# EasyEDA Pro project OURs_PHONE_EPRO_FILE_2025-04-21.epro, schematic OURS PHONE_CONNECTORS_FLIP

## Sheets
1 CONNECTORS: Board Name: OURS PHONE_CONNECTORS_FLIP; Create Date: 2024-12-30; Page Name: CONNECTORS; Project Name: BackupProjects_abdulrehmanbinafsar_personal_0_20241230; Schematic Name: OURS PHONE_CONNECTORS_FLIP; Update Date: 2025-01-07; Add into BOM: yes; Company: Your Company; Convert to PCB: yes; Date: 2024-12-04; Draw By: Abdul Rehman; REV: 1.0; Sheet: 1/1
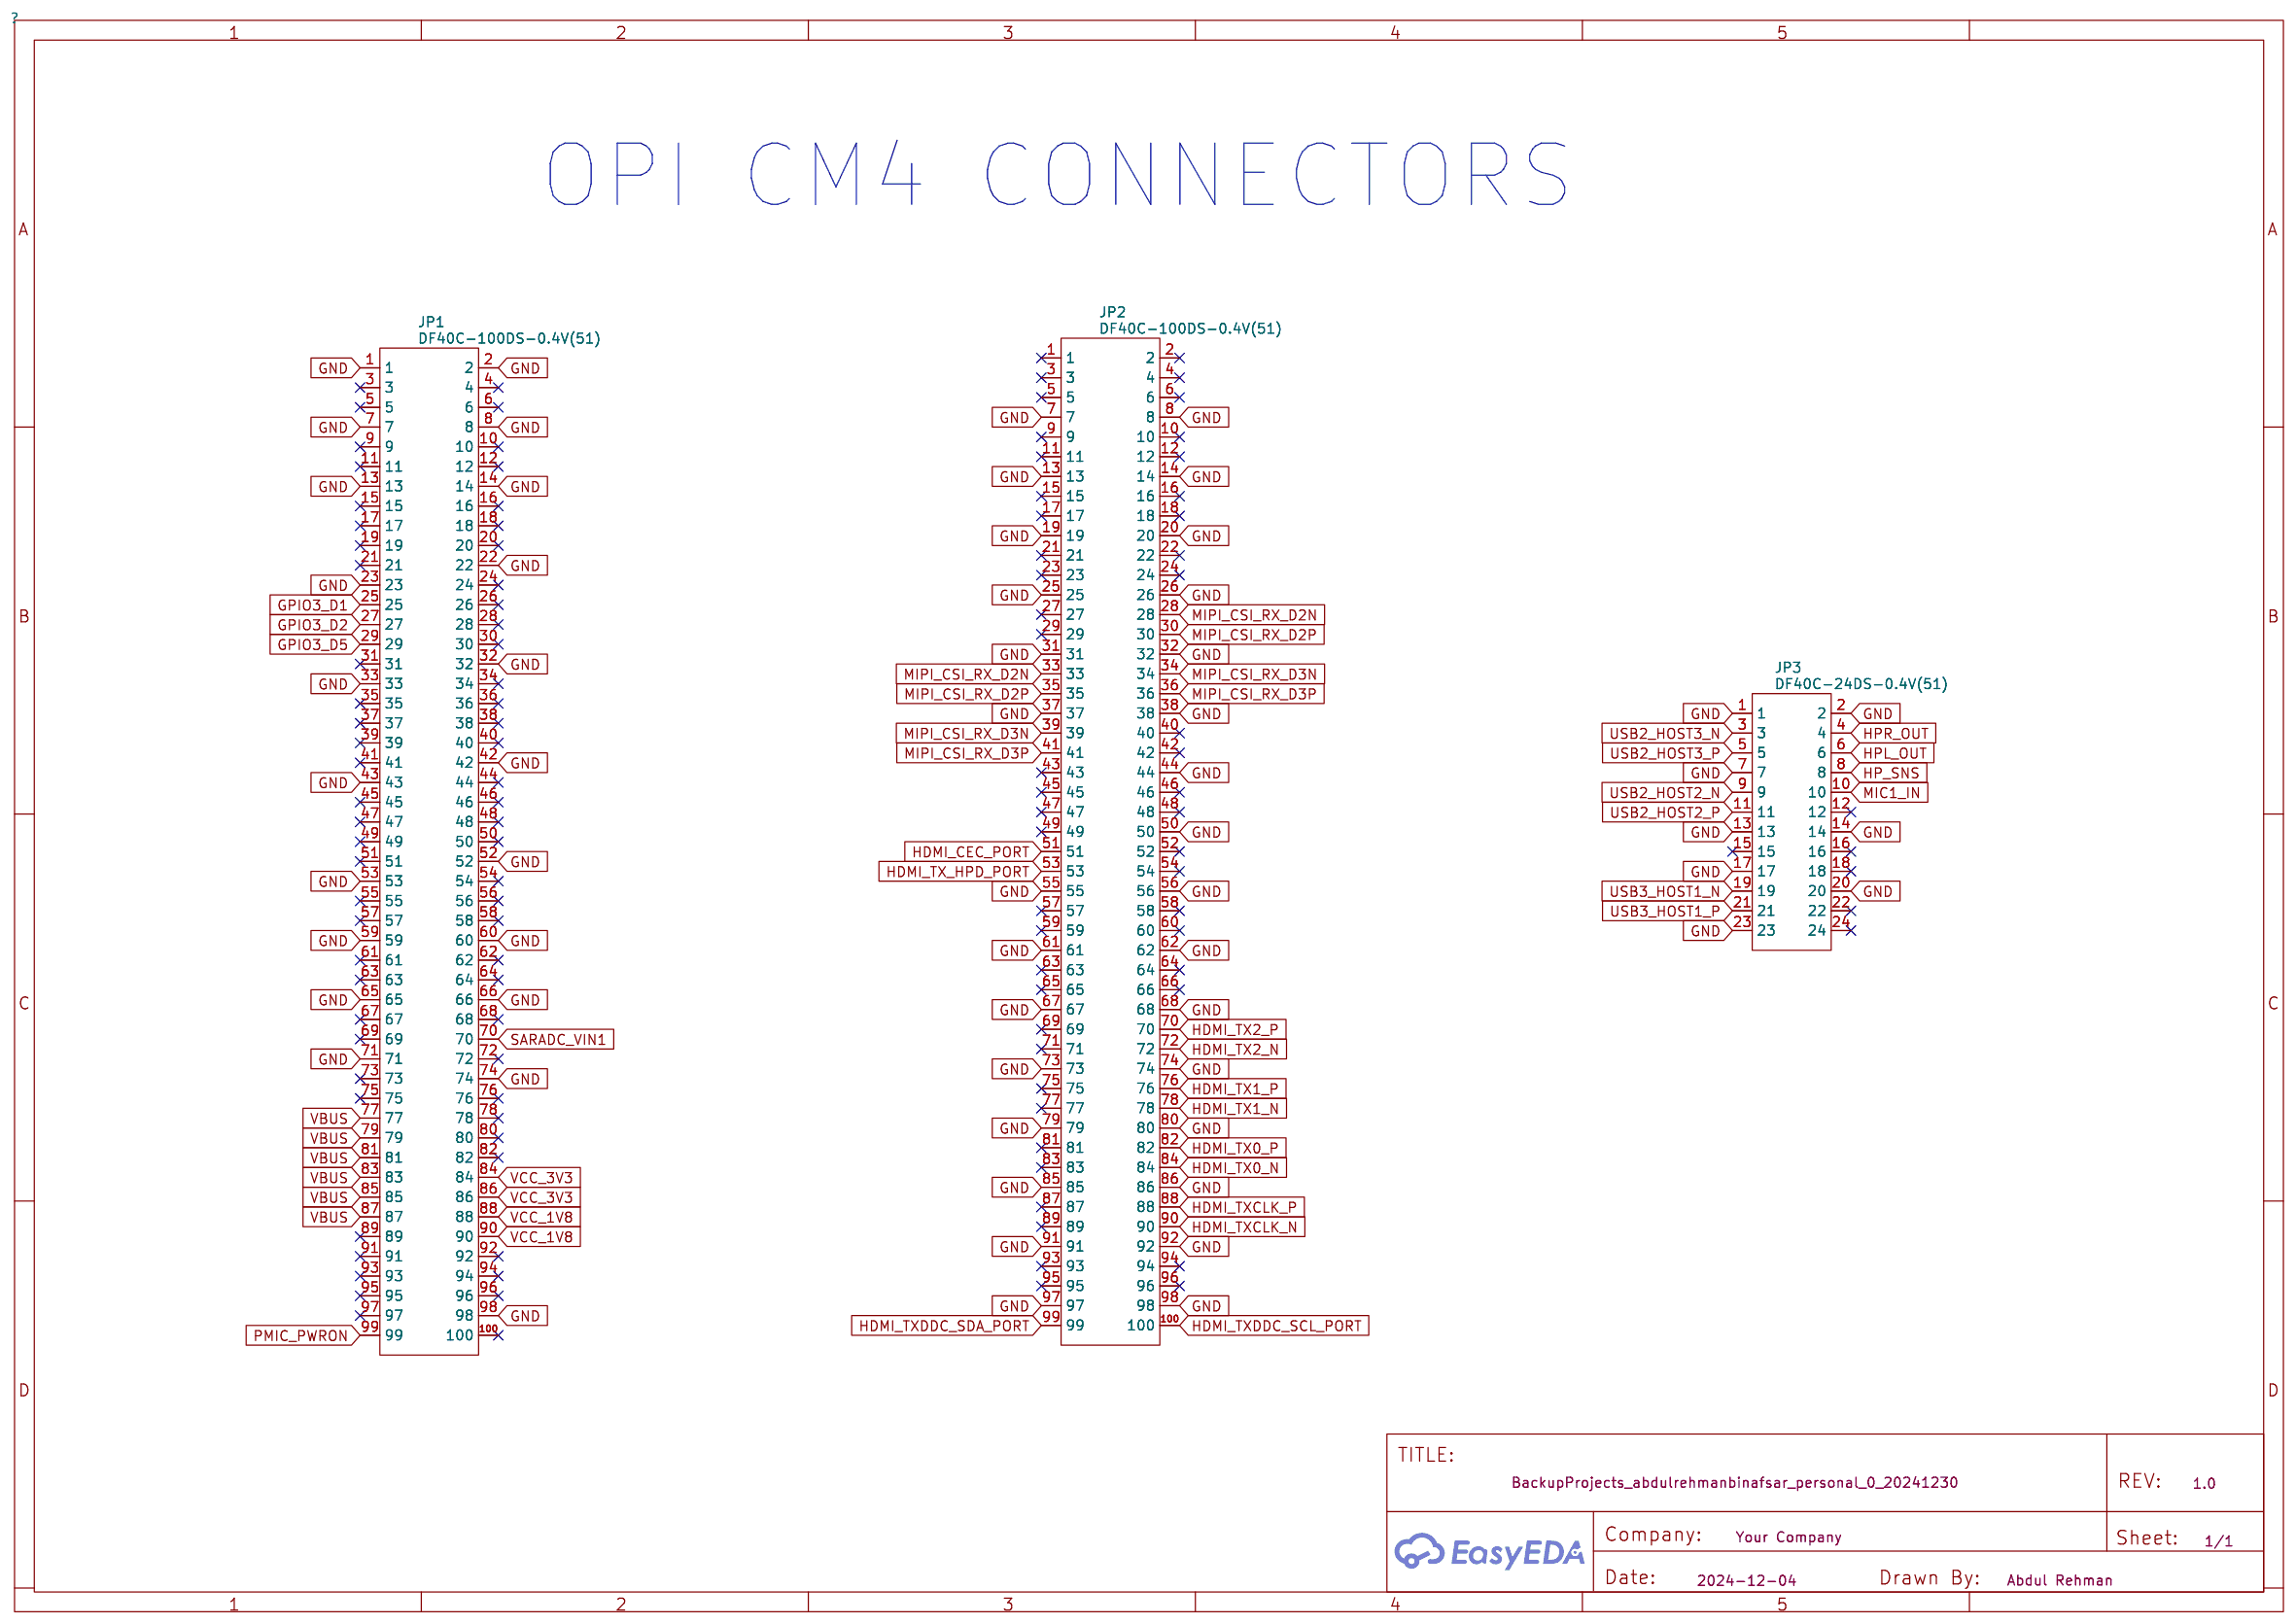
[diagram p0: CONNECTORS]
2 CIRCUITRY: Page Name: CIRCUITRY; Update Date: 2025-01-22; Date: 2024-12-06
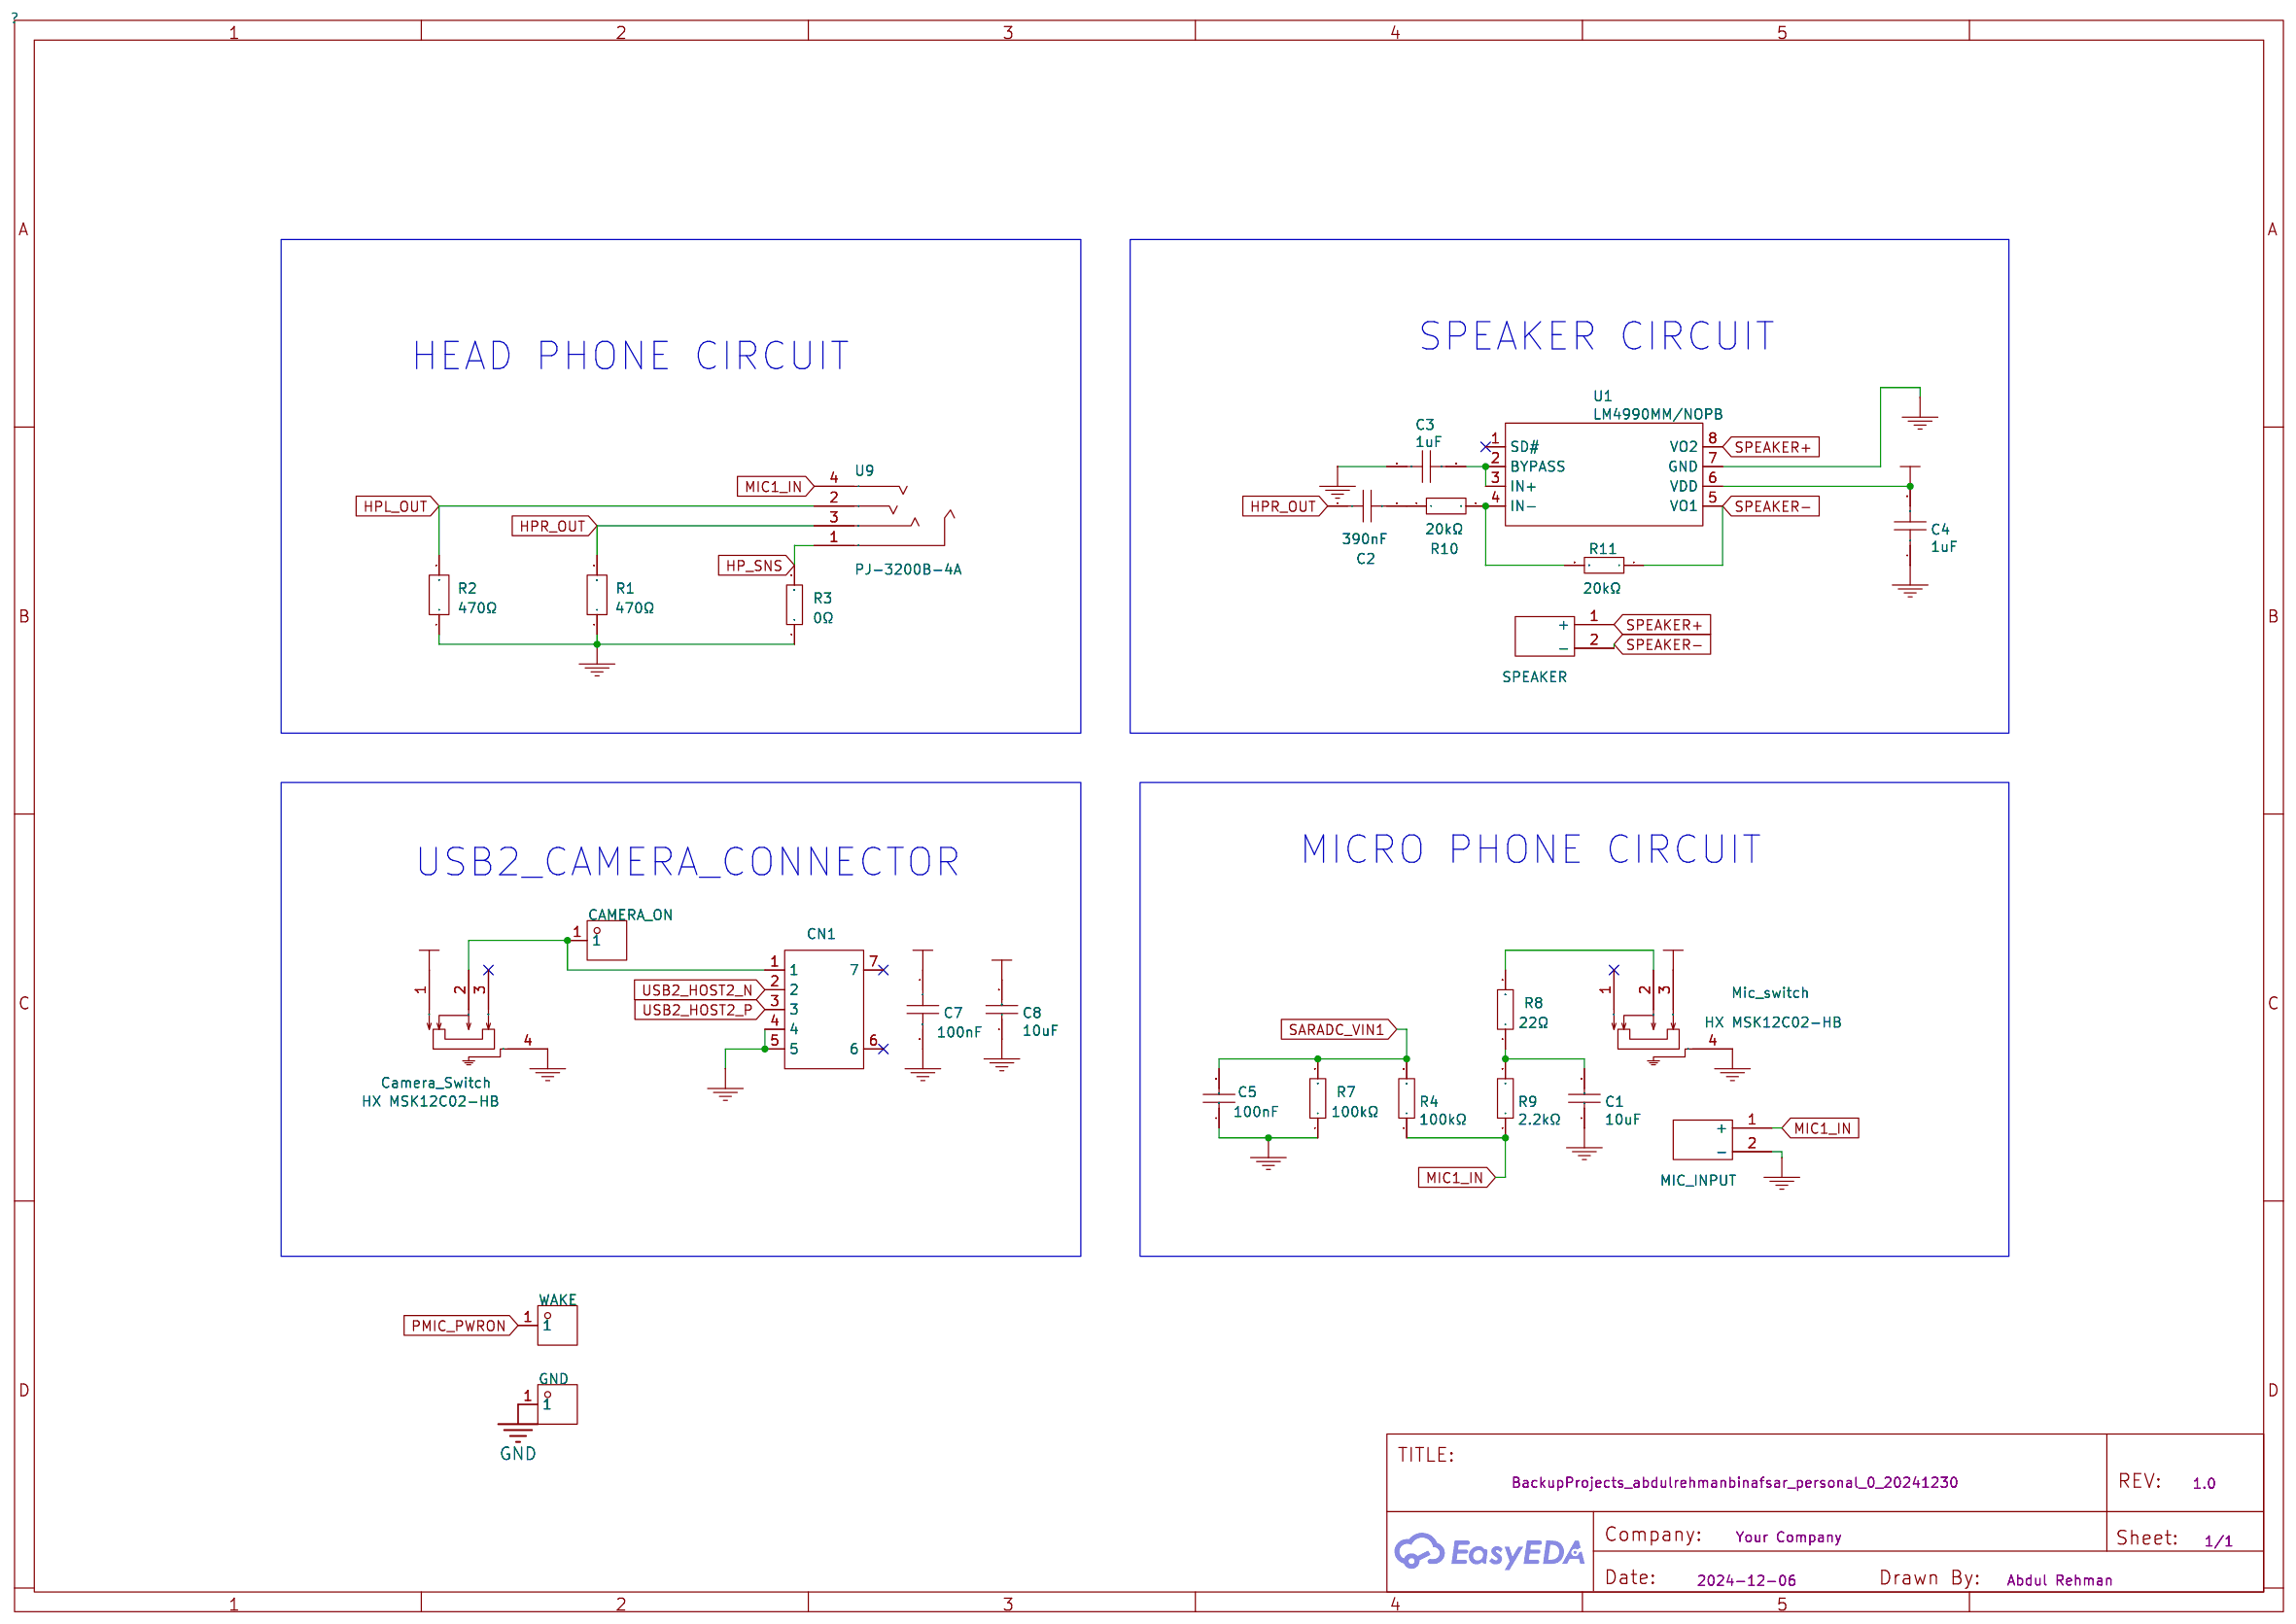
[diagram p1: CIRCUITRY]
3 SIM Module: Page Name: SIM Module; Update Date: 2025-01-22; Date: 2024-12-06
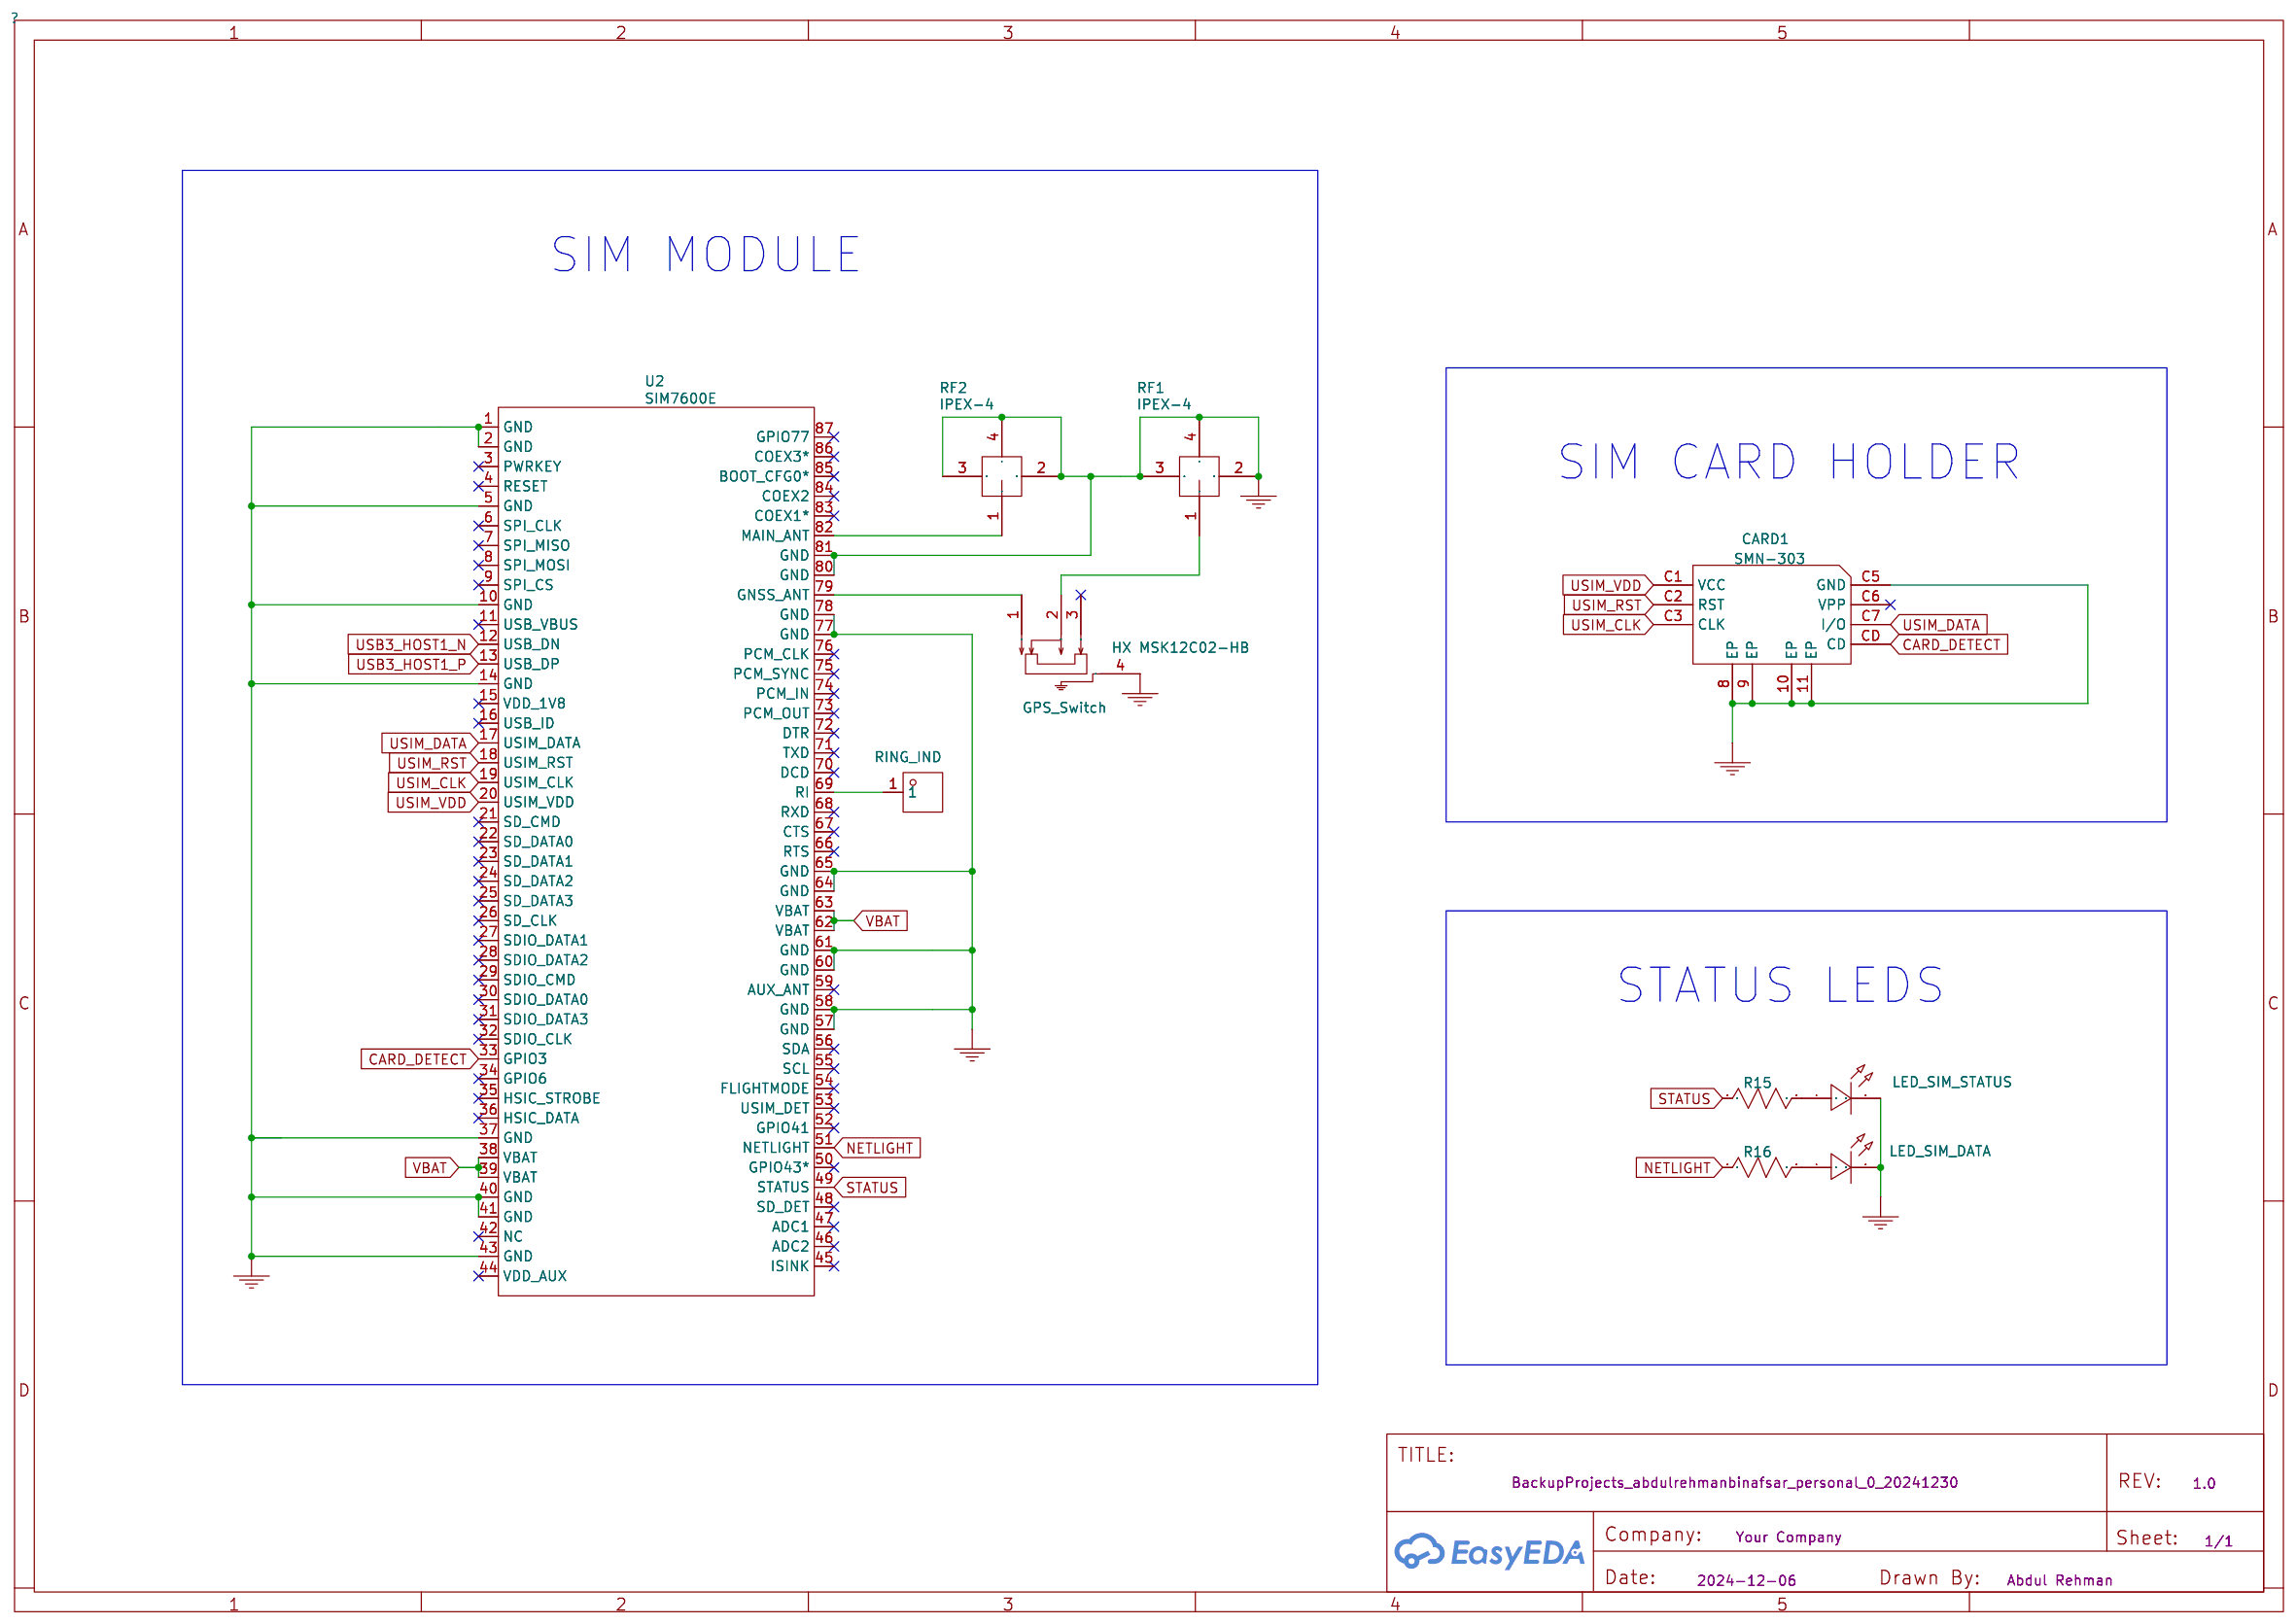
[diagram p2: SIM Module]
4 CPBR CIRCUIT: Page Name: CPBR CIRCUIT; Update Date: 2025-01-22; Date: 2024-12-08
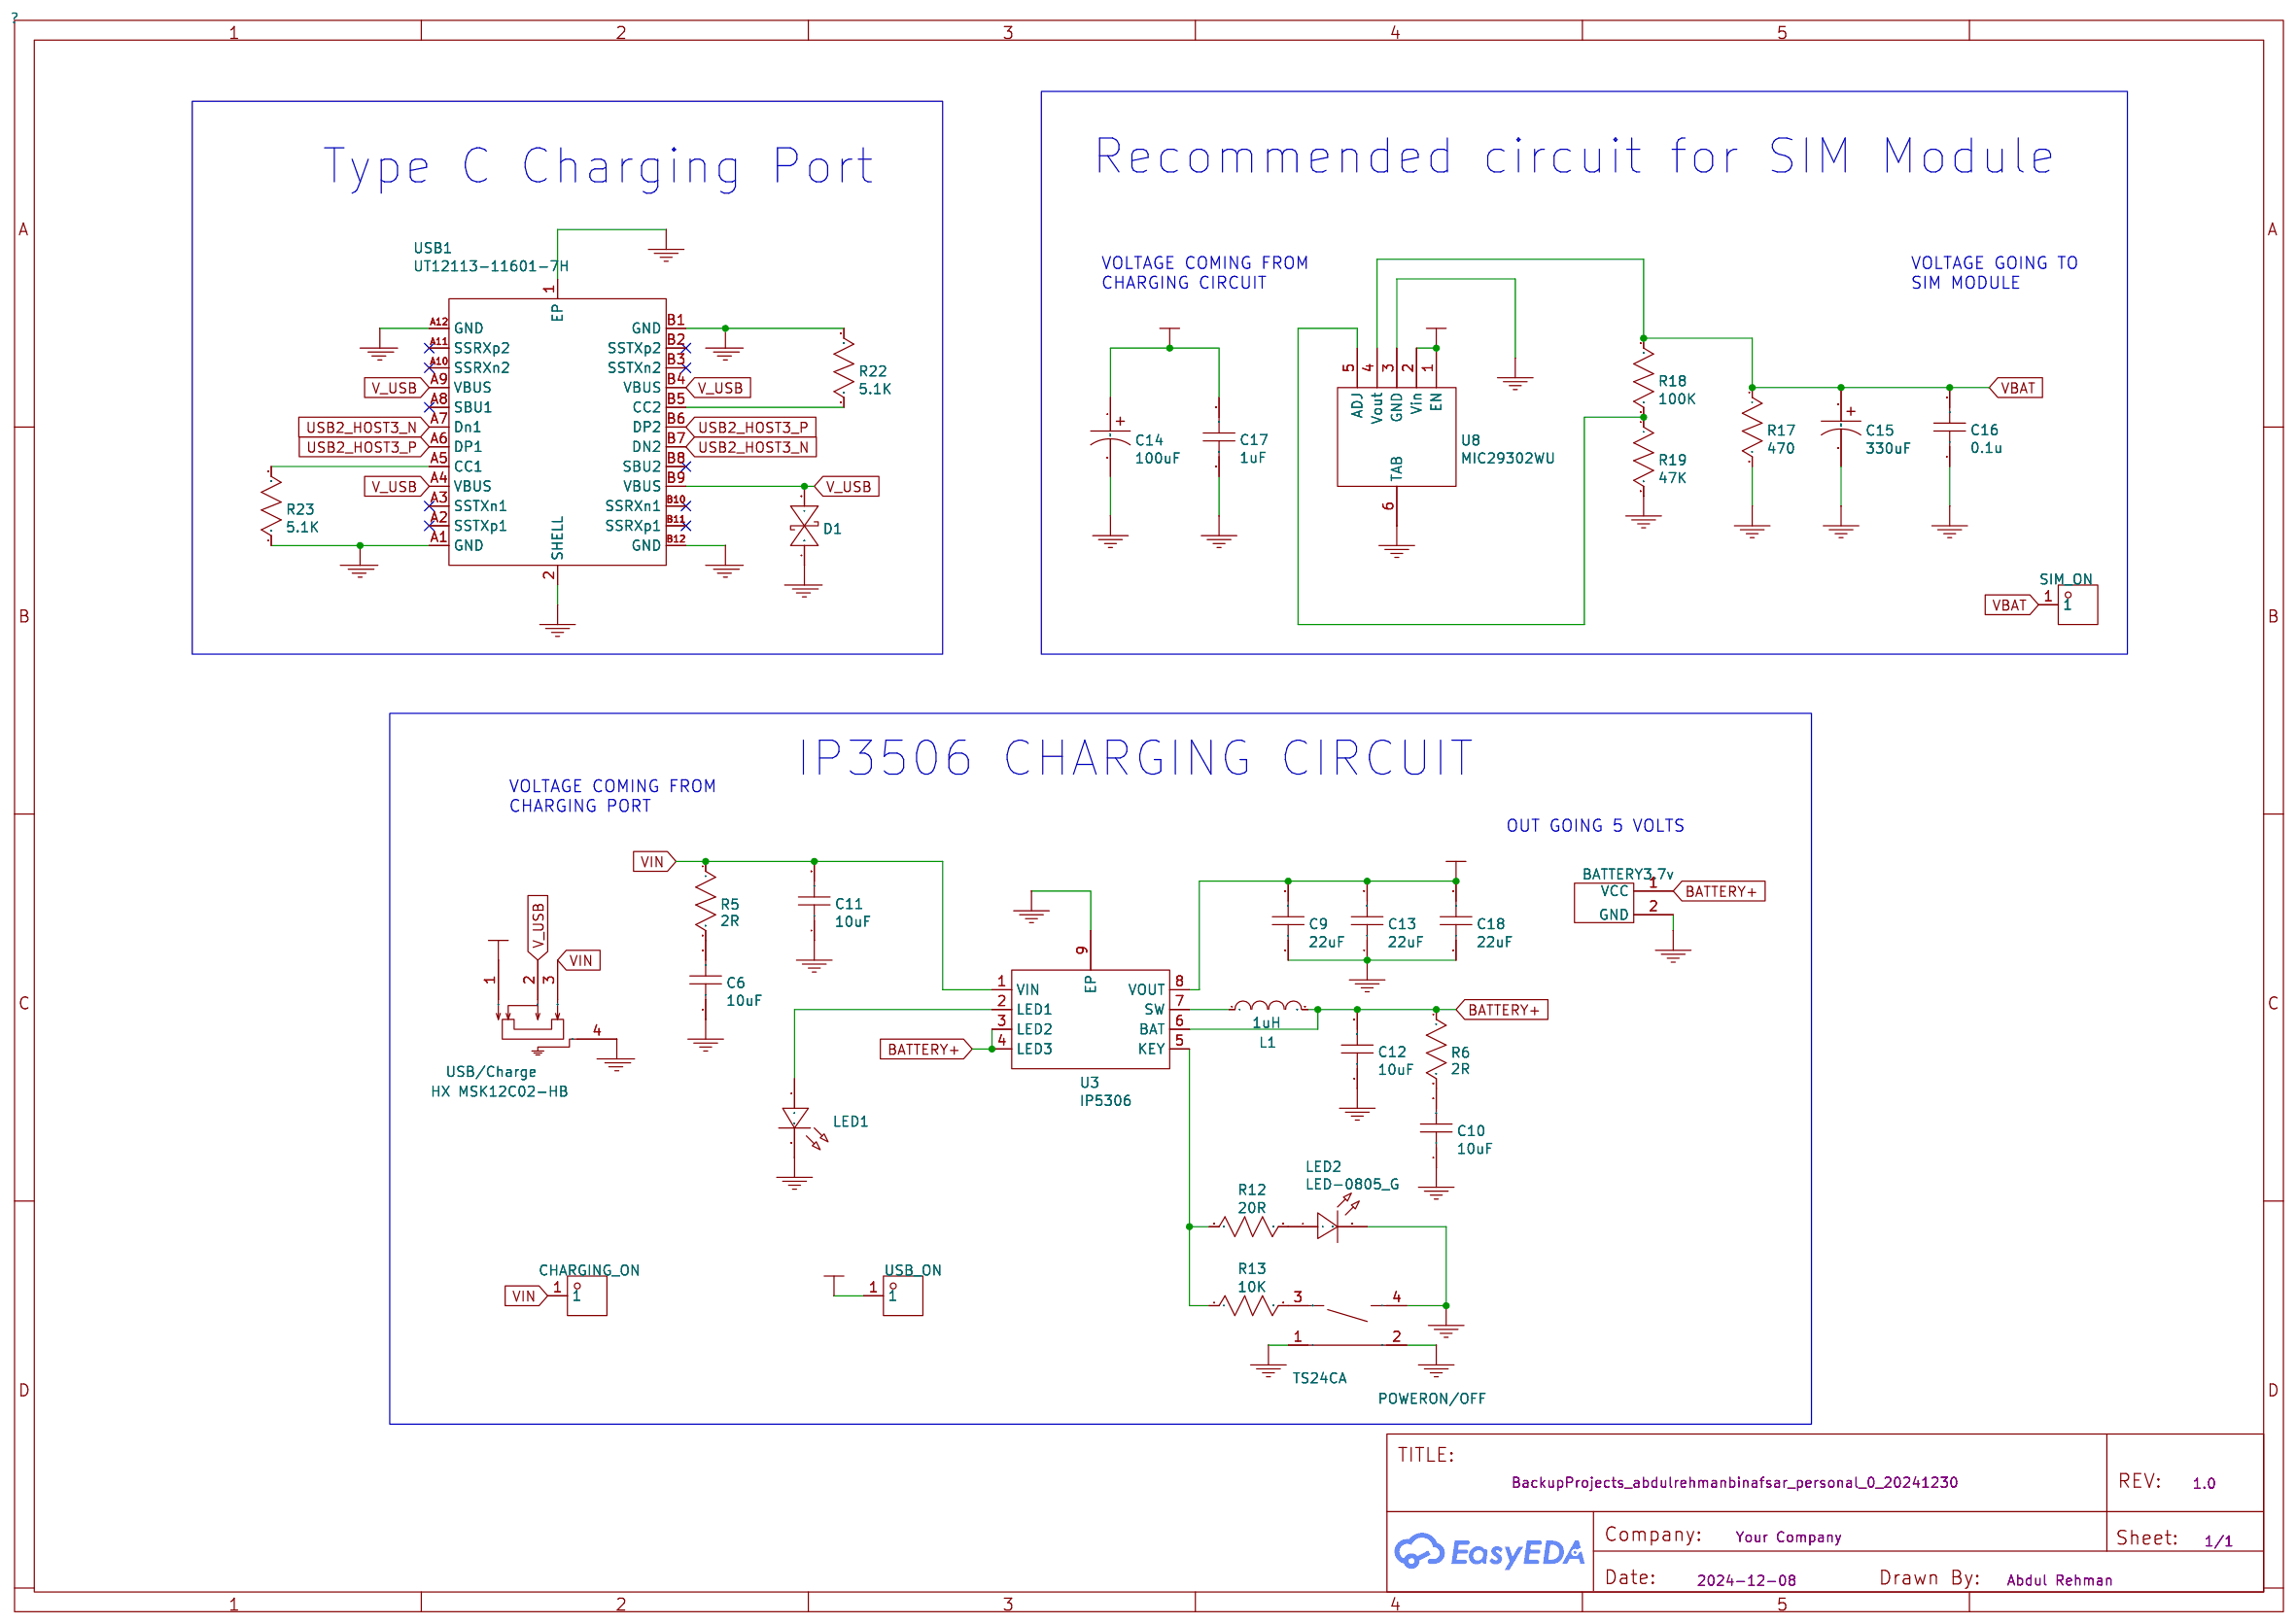
[diagram p3: CPBR CIRCUIT]
5 HDMI PORT: Page Name: HDMI PORT; Update Date: 2025-01-22; Date: 2024-12-09
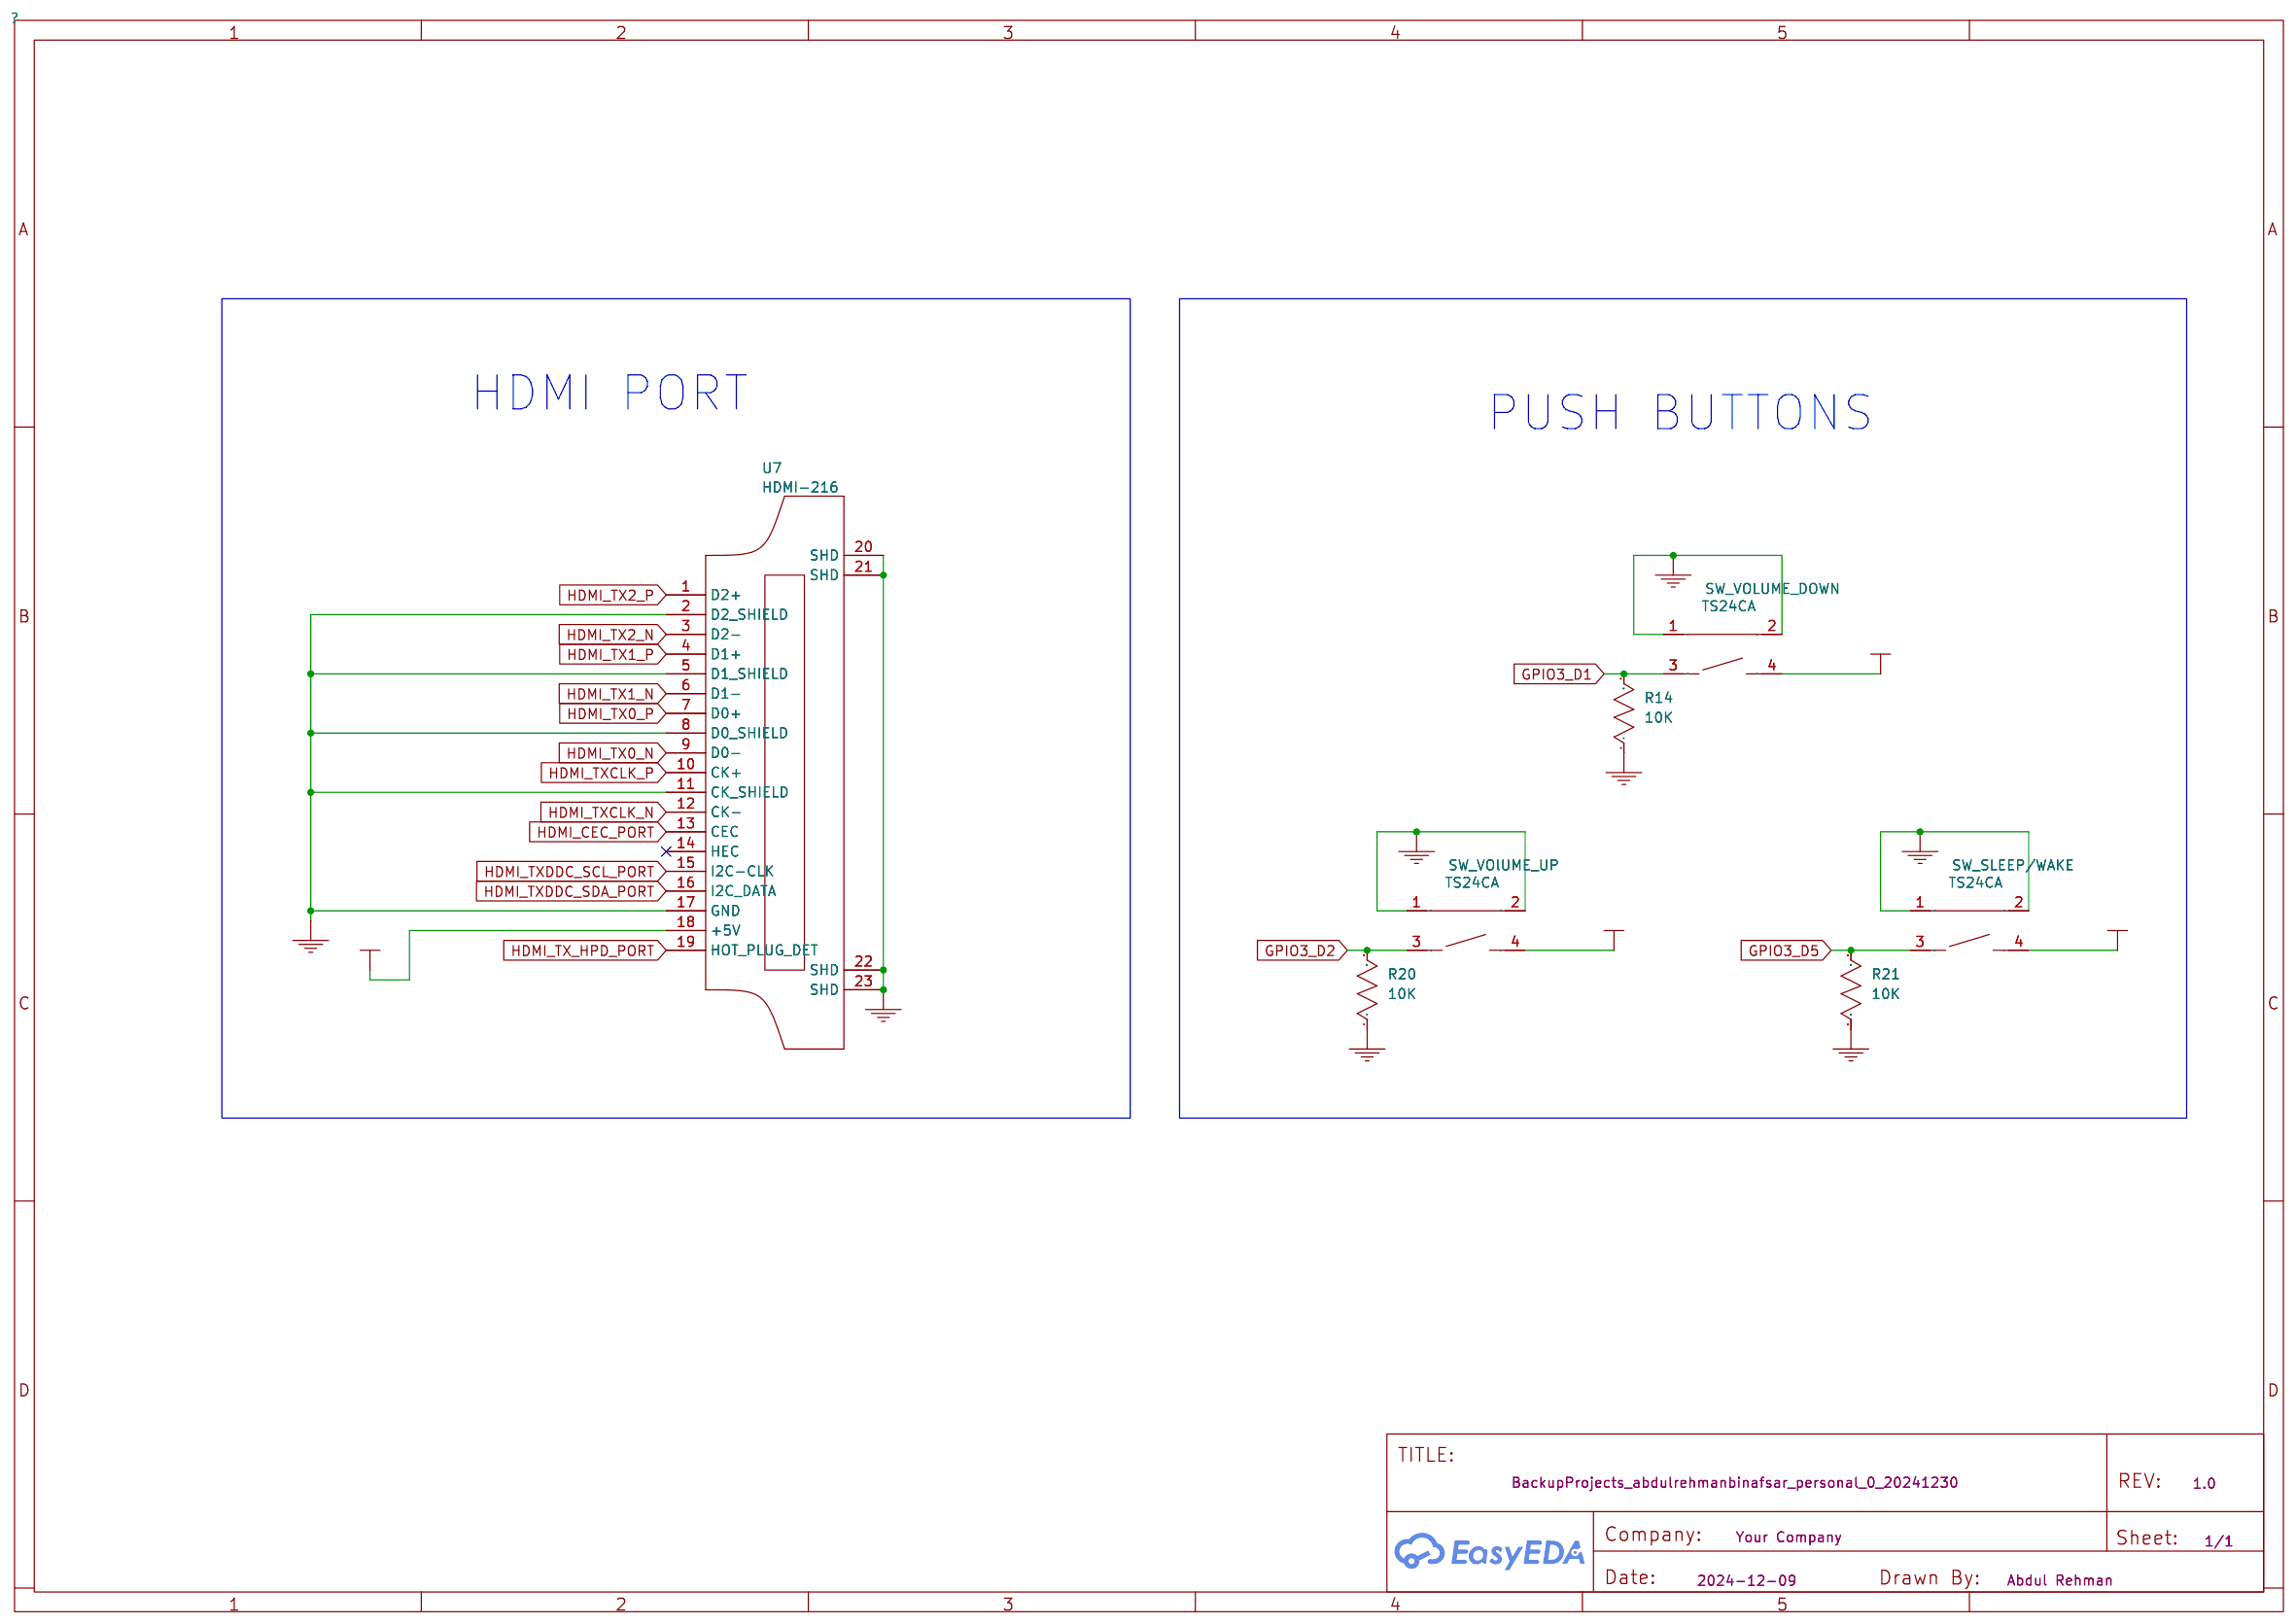
[diagram p4: HDMI PORT]

## Parts
sheet CIRCUITRY
C1  10uF  [C0402]
C2  390nF  [C0402]
C3  1uF  [C0402]
C4  1uF  [C0402]
C5  100nF  [C0402]
C7  100nF  [C0402]
C8  10uF  [C0402]
CAMERA_ON  TP-橘色测试点  [TESTPOINT-TH_BD3.2]  (no BOM)
Camera_Switch  HX MSK12C02-HB  [SW-SMD_MSK12C02-HB]
CN1  SM05B-SRSS-TB (LF)(SN)  [CONN-SMD_SM05B-SRSS-TB-LF-SN]
GND  TP-橘色测试点  [TESTPOINT-TH_BD3.2]  (no BOM)
MIC_INPUT  NOB  [BATTERY SYMBOL]  (no BOM)
Mic_switch  HX MSK12C02-HB  [SW-SMD_MSK12C02-HB]
R1  470Ω  [R0402]
R2  470Ω  [R0402]
R3  0Ω  [R0402]
R4  100kΩ  [R0402]
R7  100kΩ  [R0402]
R8  22Ω  [R0402]
R9  2.2kΩ  [R0402]
R10  20kΩ  [R0402]
R11  20kΩ  [R0402]
SPEAKER  NOB  [BATTERY SYMBOL]  (no BOM)
U1  LM4990MM/NOPB  [MSOP-8_L3.0-W3.0-P0.65-LS5.0-BL]
U9  PJ-3200B-4A  [AUDIO-TH_PJ-3200B-4A]
WAKE  TP-橘色测试点  [TESTPOINT-TH_BD3.2]  (no BOM)
sheet CONNECTORS
JP1  DF40C-100DS-0.4V(51)  [CONN-SMD_DF40C-100DS-0.4V-51]
JP2  DF40C-100DS-0.4V(51)  [CONN-SMD_DF40C-100DS-0.4V-51]
JP3  DF40C-24DS-0.4V(51)  [CONN-SMD_DF40C-24DS-0.4V51]
sheet CPBR CIRCUIT
BATTERY3.7v  NOB  [BATTERY SYMBOL]  (no BOM)
C6  10uF  [C0805]
C9  22uF  [C0805]
C10  10uF  [C0805]
C11  10uF  [C0805]
C12  10uF  [C0805]
C13  22uF  [C0805]
C14  100uF  [CASE-A_3216]
C15  330uF  [CASE-A_3216]
C16  0.1u  [C1206]
C17  1uF  [C1206]
C18  22uF  [C0805]
CHARGING_ON  TP-橘色测试点  [TESTPOINT-TH_BD3.2]  (no BOM)
D1  AZ5825-01F  [DFN-2L_L1.0-W0.6-P0.65-BI]
L1  1uH  [IND-SMD_L2.5-W2.0]
LED1  LED-0603_G  [LED0603_GREEN]
LED2  LED-0805_G  [LED0805_GREEN]
POWERON/OFF  TS24CA  [SW-SMD_TS24CA]
R5  2R  [R0603]
R6  2R  [R0603]
R12  20R  [R0603]
R13  10K  [R0603]
R17  470  [R1206]
R18  100K  [R1206]
R19  47K  [R1206]
R22  5.1K  [R0805]
R23  5.1K  [R0805]
SIM_ON  TP-橘色测试点  [TESTPOINT-TH_BD3.2]  (no BOM)
U3  IP5306  [ESOP-8_L4.9-W3.9-P1.27-LS6.0-BL-EP]
U8  MIC29302WU  [TO-263-5_L10.2-W9.9-P1.70-LS14.4-TL]
USB1  UT12113-11601-7H  [USB-C-SMD_UT12113-11601-7H]
USB/Charge  HX MSK12C02-HB  [SW-SMD_MSK12C02-HB]
USB_ON  TP-橘色测试点  [TESTPOINT-TH_BD3.2]  (no BOM)
sheet HDMI PORT
R14  10K  [R0603]
R20  10K  [R0603]
R21  10K  [R0603]
SW_SLEEP/WAKE  TS24CA  [SW-SMD_TS24CA]
SW_VOLUME_DOWN  TS24CA  [SW-SMD_TS24CA]
SW_VOlUME_UP  TS24CA  [SW-SMD_TS24CA]
U7  HDMI-216  [HDMI-SMD_KH-HDMI-19P-CU]
sheet SIM Module
CARD1  SMN-303  [SIM-SMD_SMN-303]
GPS_Switch  HX MSK12C02-HB  [SW-SMD_MSK12C02-HB]
LED_SIM_DATA  LED-0805_R  [LED0805_RED]
LED_SIM_STATUS  LED-0805_B  [LED0805_BLUE]
R15  65R  [R0805]
R16  65R  [R0805]
RF1  IPEX-4  [IPEX-SMD_4P-L1.8-W1.7-LS2.0]
RF2  IPEX-4  [IPEX-SMD_4P-L1.8-W1.7-LS2.0]
RING_IND  TP-橘色测试点  [TESTPOINT-TH_BD3.2]  (no BOM)
U2  SIM7600E  [COMM-SMD_L30.0-W30.0_SIM7600E]

## Library data of the parts
C1 C8 = 10uF: Supplier: LCSC; Manufacturer: YAGEO(国巨); Manufacturer Part: CL05A106MQ5NUNC; Supplier Part: C15525; JLCPCB Part Class: Extended Part
C2 = 390nF: Supplier: LCSC; Supplier Part: C7393858; Manufacturer: CCTC(三环); Manufacturer Part: TCC0402X5R394K160AT; JLCPCB Part Class: Extended Part
C3 C4 = 1uF: Supplier: LCSC; Supplier Part: C318573; Manufacturer: SAMSUNG(三星); Manufacturer Part: CL05A105MQ5NNNC; JLCPCB Part Class: Extended Part
C5 = 100nF: Supplier: LCSC; Supplier Part: C106204; Manufacturer: YAGEO(国巨); Manufacturer Part: CC0402KRX5R7BB104; JLCPCB Part Class: Extended Part
C7 = 100nF: Supplier: LCSC; Supplier Part: C576741; Manufacturer: YAGEO(国巨); Manufacturer Part: CC0402MRX5R7BB104; JLCPCB Part Class: Extended Part
CAMERA_ON CHARGING_ON GND RING_IND SIM_ON USB_ON WAKE = TP-橘色测试点: Supplier Part: C9900007421; Supplier Footprint: TESTPOINT-TH_BD-2P-P2.00; JLCPCB Part Class: Extended Part; Supplier: LCSC
Camera_Switch GPS_Switch Mic_switch USB/Charge = HX MSK12C02-HB: Supplier: LCSC; Supplier Part: C5149817; Manufacturer: hanxia(韩下); JLCPCB Part Class: Extended Part
CN1 = SM05B-SRSS-TB (LF)(SN): Supplier: LCSC; Supplier Part: C136657; Manufacturer: JST; Manufacturer Part: SM05B-SRSS-TB(LF)(SN); JLCPCB Part Class: Extended Part
BATTERY3.7v MIC_INPUT SPEAKER = NOB
R1 R2 = 470Ω: Supplier: LCSC; Supplier Part: C881295; Manufacturer: EVER OHMS(天二科技); Manufacturer Part: CR0402J470RQ10Z; JLCPCB Part Class: Extended Part
R3 = 0Ω: Supplier: LCSC; Supplier Part: C17168; Manufacturer: UNI-ROYAL(Uniroyal Elec); Manufacturer Part: 0402WGF0000TCE; JLCPCB Part Class: Extended Part
R4 R7 = 100kΩ: Supplier: LCSC; Manufacturer: YAGEO(国巨); Manufacturer Part: AC0402JR-07100KL; Supplier Part: C144732; JLCPCB Part Class: Extended Part
R8 = 22Ω: Supplier: LCSC; Supplier Part: C25092; Manufacturer: UNI-ROYAL(Uniroyal Elec); Manufacturer Part: 0402WGF220JTCE; JLCPCB Part Class: Extended Part
R9 = 2.2kΩ: Supplier: LCSC; Supplier Part: C269678; Manufacturer: Tyohm(幸亚电阻); Manufacturer Part: RMC04022.2K5%N; JLCPCB Part Class: Extended Part
R10 R11 = 20kΩ: Supplier: LCSC; Manufacturer: YAGEO(国巨); Manufacturer Part: RC0402FR-0720KL; Supplier Part: C93942; JLCPCB Part Class: Extended Part
U1 = LM4990MM/NOPB: Supplier: LCSC; Manufacturer: TI(德州仪器); Supplier Part: C8958; JLCPCB Part Class: Extended Part
U9 = PJ-3200B-4A: Connector Type:3.5mm耳机座 Current Rating (Max):500mA Voltage Rating (Max):30V; LCSC Part Name: 3.5mm耳机座; Supplier Part: C136687; Manufacturer: 韩国韩荣; Supplier Footprint: 插件; JLCPCB Part Class: Extended Part; Datasheet: https://atta.szlcsc.com/upload/public/pdf/source/20210429/C136687_4CC2DC59D4F83D423B9C10D95C628283.pdf; Supplier: LCSC; Connector Type: 3.5mm耳机座; Current Rating (Max): 500mA; Voltage Rating (Max): 30V
JP1 JP2 = DF40C-100DS-0.4V(51): Supplier: LCSC; Supplier Part: C597931; Manufacturer: HRS(广濑); JLCPCB Part Class: Extended Part
JP3 = DF40C-24DS-0.4V(51): Supplier: LCSC; Supplier Part: C424640; Manufacturer: HRS(广濑); JLCPCB Part Class: Extended Part
C6 C10-C12 = 10uF: Supplier Part: C15850; Supplier: LCSC; Manufacturer Part: CL21A106KAYNNNE; TOLERANCE: 10%; Manufacturer: Samsung Electro-Mechanics
C9 C13 C18 = 22uF: Supplier Part: C602037; Supplier: LCSC; Manufacturer Part: CL21A226MAYNNNE; TOLERANCE: 10%; Manufacturer: Samsung Electro-Mechanics
C14 = 100uF: Supplier Part: C27279; Supplier: LCSC; Manufacturer Part: TLJA107M006R0800
C15 = 330uF: Supplier Part: C5162354; Supplier: LCSC; Manufacturer Part: CS1H331M-CRG10
C16 = 0.1u: Supplier Part: C3842156; Supplier: LCSC; Manufacturer Part: 1206B104J101CT
C17 = 1uF: Supplier Part: C445688; Supplier: LCSC; Manufacturer Part: In Stock C3216X8R1H105KT000N
D1 = AZ5825-01F: Supplier: LCSC; Supplier Part: C2905641; Manufacturer: TECH PUBLIC(台舟); JLCPCB Part Class: Extended Part
L1 = 1uH: Supplier: LCSC; Supplier Part: C315711; Manufacturer: INPAQ(佳邦); Manufacturer Part: WIP252012P-1R0ML; JLCPCB Part Class: Extended Part
LED1 = LED-0603_G: Manufacturer: EVERLIGHT(台湾亿光); Manufacturer Part: PSC-1608U50GC-G4; Supplier Part: C22371298; Supplier: LCSC
LED2 = LED-0805_G: Manufacturer: 国星光电; Manufacturer Part: NCD0805G1; Supplier Part: C84260
POWERON/OFF SW_SLEEP/WAKE SW_VOLUME_DOWN SW_VOlUME_UP = TS24CA: Supplier: LCSC; Supplier Part: C393942; Manufacturer: SHOU HAN(首韩); JLCPCB Part Class: Extended Part
R5 R6 = 2R: Supplier Part: C325677; Supplier: LCSC; Manufacturer Part: RMC060321%N; TOLERANCE: 5%; Manufacturer: TyoHM
R12 = 20R: Supplier Part: C313703; Supplier: LCSC; Manufacturer Part: CRCW060320R0FKEAHP; TOLERANCE: 5%; Manufacturer: Vishay Intertech
R13 R14 R20 R21 = 10K: Supplier Part: C98220; Supplier: LCSC; Manufacturer Part: RC0603FR-0710KL; TOLERANCE: 5%; Manufacturer: YAGEO
R17 = 470: Supplier Part: C2765673; Supplier: LCSC; Manufacturer Part: CQ06W4J0471T5E; Manufacturer: UNI-ROYAL(Uniroyal Elec)
R18 = 100K: Supplier Part: C962669; Supplier: LCSC; Manufacturer Part: KTR18EZPJ104
R19 = 47K: Supplier Part: C872786; Supplier: LCSC; Manufacturer Part: RT1206FRE0747KL
R22 R23 = 5.1K: Supplier Part: C2077233; Supplier: LCSC; Manufacturer Part: CRCW080515K4FKEA
U3 = IP5306: Supplier: LCSC; Supplier Part: C181692; Manufacturer: INJOINIC(英集芯); JLCPCB Part Class: Extended Part
U8 = MIC29302WU: Supplier: LCSC; Manufacturer: MICROCHIP(美国微芯); Manufacturer Part: MIC29302WU-TR; Supplier Part: C11149; JLCPCB Part Class: Extended Part
USB1 = UT12113-11601-7H: Supplier: LCSC; Supplier Part: C2761409; Manufacturer: FOXCONN(富士康); JLCPCB Part Class: Extended Part
U7 = HDMI-216: Supplier: LCSC; Supplier Part: C2962407; Manufacturer: HANBO(汉博); JLCPCB Part Class: Extended Part
CARD1 = SMN-303: Supplier: LCSC; Supplier Part: C266888; Manufacturer: XUNPU(讯普); JLCPCB Part Class: Extended Part
LED_SIM_DATA = LED-0805_R: Manufacturer: Everlight Elec; Manufacturer Part: 17-21SURC/S530-A3/4T; Supplier Part: C2943978; Supplier: LCSC
LED_SIM_STATUS = LED-0805_B: Manufacturer: 方舟 ARKLED; Manufacturer Part: D-B080508B1-KS2; Supplier Part: C108412
R15 R16 = 65R: Supplier Part: C2907341; Supplier: LCSC; Manufacturer Part: FRC0805J680 TS
RF1 RF2 = IPEX-4: Supplier: LCSC; Supplier Part: C2987683; Manufacturer: Ziisor(致哲); JLCPCB Part Class: Extended Part
U2 = SIM7600E: Supplier: LCSC; Supplier Part: C2995536; Manufacturer: SIMCOM(芯讯通无线科技); JLCPCB Part Class: Extended Part

## Nets
+5V: C4.2 C7.1 C8.2 C9.2 C13.2 C14.1 C17.2 C18.2 Camera_Switch.1 SW_SLEEP/WAKE.4 SW_VOLUME_DOWN.4 SW_VOlUME_UP.4 U1.6(VDD) U3.8(VOUT) U7.18(+5V) U8.1(EN) U8.2(Vin) USB/Charge.1 USB_ON.1
GND: BATTERY3.7v.2(GND) C1.1 C3.1 C4.1 C5.1 C6.1 C7.2 C8.1 C9.1 C10.1 C11.1 C12.1 C13.1 C14.2 C15.2 C16.1 C17.1 C18.1 Camera_Switch.4 CARD1.8(EP) CARD1.9(EP) CARD1.10(EP) CARD1.11(EP) CARD1.C5(GND) CN1.4 CN1.5 D1.1(C) GND.1 GPS_Switch.4 JP1.1 JP1.2 JP1.7 JP1.8 JP1.13 JP1.14 JP1.22 JP1.23 JP1.32 JP1.33 JP1.42 JP1.43 JP1.52 JP1.53 JP1.59 JP1.60 JP1.65 JP1.66 JP1.71 JP1.74 JP1.98 JP2.7 JP2.8 JP2.13 JP2.14 JP2.19 JP2.20 JP2.25 JP2.26 JP2.31 JP2.32 JP2.37 JP2.38 JP2.44 JP2.50 JP2.55 JP2.56 JP2.61 JP2.62 JP2.67 JP2.68 JP2.73 JP2.74 JP2.79 JP2.80 JP2.85 JP2.86 JP2.91 JP2.92 JP2.97 JP2.98 JP3.1 JP3.2 JP3.7 JP3.13 JP3.14 JP3.17 JP3.20 JP3.23 LED1.2 LED2.2 LED_SIM_DATA.2 LED_SIM_STATUS.2 MIC_INPUT.2(-) Mic_switch.4 POWERON/OFF.1 POWERON/OFF.2 POWERON/OFF.4 R1.1 R2.1 R3.1 R7.1 R14.1 R17.2 R19.2 R20.1 R21.1 R22.2 R23.1 RF1.2 RF1.3 RF1.4 RF2.2 RF2.3 RF2.4 SW_SLEEP/WAKE.1 SW_SLEEP/WAKE.2 SW_VOLUME_DOWN.1 SW_VOLUME_DOWN.2 SW_VOlUME_UP.1 SW_VOlUME_UP.2 U1.7(GND) U2.1(GND) U2.2(GND) U2.5(GND) U2.10(GND) U2.14(GND) U2.37(GND) U2.40(GND) U2.41(GND) U2.43(GND) U2.57(GND) U2.58(GND) U2.60(GND) U2.61(GND) U2.64(GND) U2.65(GND) U2.77(GND) U2.78(GND) U2.80(GND) U2.81(GND) U3.9(EP) U7.2(D2_SHIELD) U7.5(D1_SHIELD) U7.8(D0_SHIELD) U7.11(CK_SHIELD) U7.17(GND) U7.20(SHD) U7.21(SHD) U7.22(SHD) U7.23(SHD) U8.3(GND) U8.6(TAB) USB1.1(EP) USB1.2(SHELL) USB1.A1(GND) USB1.A12(GND) USB1.B1(GND) USB1.B12(GND) USB/Charge.4
VBAT: C15.1 C16.2 R17.1 R18.1 SIM_ON.1 U2.38(VBAT) U2.39(VBAT) U2.62(VBAT) U2.63(VBAT) U8.4(Vout)
VBUS: JP1.77 JP1.79 JP1.81 JP1.83 JP1.85 JP1.87
VCC_1V8: JP1.88 JP1.90
VCC_3V3: JP1.84 JP1.86 Mic_switch.3
VIN: C11.2 CHARGING_ON.1 R5.1 U3.1(VIN) USB/Charge.3
BATTERY+: BATTERY3.7v.1(VCC) C12.2 L1.2 R6.1 U3.3(LED2) U3.4(LED3) U3.6(BAT)
CARD_DETECT: CARD1.CD U2.33(GPIO3)
GPIO3_D1: JP1.25 R14.2 SW_VOLUME_DOWN.3
GPIO3_D2: JP1.27 R20.2 SW_VOlUME_UP.3
GPIO3_D5: JP1.29 R21.2 SW_SLEEP/WAKE.3
HDMI_CEC_PORT: JP2.51 U7.13(CEC)
HDMI_TX0_N: JP2.84 U7.9(D0-)
HDMI_TX0_P: JP2.82 U7.7(D0+)
HDMI_TX1_N: JP2.78 U7.6(D1-)
HDMI_TX1_P: JP2.76 U7.4(D1+)
HDMI_TX2_N: JP2.72 U7.3(D2-)
HDMI_TX2_P: JP2.70 U7.1(D2+)
HDMI_TX_HPD_PORT: JP2.53 U7.19(HOT_PLUG_DET)
HDMI_TXCLK_N: JP2.90 U7.12(CK-)
HDMI_TXCLK_P: JP2.88 U7.10(CK+)
HDMI_TXDDC_SCL_PORT: JP2.100 U7.15(I2C-CLK)
HDMI_TXDDC_SDA_PORT: JP2.99 U7.16(I2C_DATA)
HP_SNS: JP3.8 R3.2 U9.1
HPL_OUT: JP3.6 R2.2 U9.2
HPR_OUT: C2.1 JP3.4 R1.2 U9.3
MIC1_IN: JP3.10 MIC_INPUT.1(+) R4.1 R9.1 U9.4
MIPI_CSI_RX_D2N: JP2.28 JP2.33
MIPI_CSI_RX_D2P: JP2.30 JP2.35
MIPI_CSI_RX_D3N: JP2.34 JP2.39
MIPI_CSI_RX_D3P: JP2.36 JP2.41
NETLIGHT: R16.1 U2.51(NETLIGHT)
PMIC_PWRON: JP1.99 WAKE.1
SARADC_VIN1: C5.2 JP1.70 R4.2 R7.2
SPEAKER+: SPEAKER.1(+) U1.8(VO2)
SPEAKER-: R11.1 SPEAKER.2(-) U1.5(VO1)
STATUS: R15.1 U2.49(STATUS)
USB2_HOST2_N: CN1.2 JP3.9
USB2_HOST2_P: CN1.3 JP3.11
USB2_HOST3_N: JP3.3 USB1.A7(Dn1) USB1.B7(DN2)
USB2_HOST3_P: JP3.5 USB1.A6(DP1) USB1.B6(DP2)
USB3_HOST1_N: JP3.19 U2.12(USB_DN)
USB3_HOST1_P: JP3.21 U2.13(USB_DP)
USIM_CLK: CARD1.C3(CLK) U2.19(USIM_CLK)
USIM_DATA: CARD1.C7(I/O) U2.17(USIM_DATA)
USIM_RST: CARD1.C2(RST) U2.18(USIM_RST)
USIM_VDD: CARD1.C1(VCC) U2.20(USIM_VDD)
V_USB: D1.2(A) USB1.A4(VBUS) USB1.A9(VBUS) USB1.B4(VBUS) USB1.B9(VBUS) USB/Charge.2
$2N2: CAMERA_ON.1 Camera_Switch.2 CN1.1
$2N7: C3.2 U1.2(BYPASS) U1.3(IN+)
$2N10: R10.2 R11.2 U1.4(IN-)
$2N12: C1.2 R8.1 R9.2
$2N528: C2.2 R10.1
$2N1557: Mic_switch.2 R8.2
$3N1: RF2.1 U2.82(MAIN_ANT)
$3N2: GPS_Switch.1 U2.79(GNSS_ANT)
$3N283: LED_SIM_STATUS.1 R15.2
$3N284: LED_SIM_DATA.1 R16.2
$3N841: GPS_Switch.2 RF1.1
$3N4722: RING_IND.1 U2.69(RI)
$4N10: R18.2 R19.1 U8.5(ADJ)
$4N12: LED1.1 U3.2(LED1)
$4N15: L1.1 U3.7(SW)
$4N20: R12.1 R13.1 U3.5(KEY)
$4N26: R23.2 USB1.A5(CC1)
$4N691: C6.2 R5.2
$4N693: LED2.1 R12.2
$4N694: POWERON/OFF.3 R13.2
Net-(C10-2): C10.2 R6.2
Net-(R22-1): R22.1 USB1.B5(CC2)

Not connected (* = marked no-connect by the designer): Camera_Switch 3*; CARD1 C6(VPP)*; CN1 6* 7*; GPS_Switch 3*; JP1 3* 4* 5* 6* 9* 10* 11* 12* 15* 16* 17* 18* 19* 20* 21* 24* 26* 28* 30* 31* 34* 35* 36* 37* 38* 39* 40* 41* 44* 45* 46* 47* 48* 49* 50* 51* 54* 55* 56* 57* 58* 61* 62* 63* 64* 67* 68* 69* 72* 73* 75* 76* 78* 80* 82* 89* 91* 92* 93* 94* 95* 96* 97* 100*; JP2 1* 2* 3* 4* 5* 6* 9* 10* 11* 12* 15* 16* 17* 18* 21* 22* 23* 24* 27* 29* 40* 42* 43* 45* 46* 47* 48* 49* 52* 54* 57* 58* 59* 60* 63* 64* 65* 66* 69* 71* 75* 77* 81* 83* 87* 89* 93* 94* 95* 96*; JP3 12* 15* 16* 18* 22* 24*; Mic_switch 1*; U1 1(SD#)*; U2 3(PWRKEY)* 4(RESET)* 6(SPI_CLK)* 7(SPI_MISO)* 8(SPI_MOSI)* 9(SPI_CS)* 11(USB_VBUS)* 15(VDD_1V8)* 16(USB_ID)* 21(SD_CMD)* 22(SD_DATA0)* 23(SD_DATA1)* 24(SD_DATA2)* 25(SD_DATA3)* 26(SD_CLK)* 27(SDIO_DATA1)* 28(SDIO_DATA2)* 29(SDIO_CMD)* 30(SDIO_DATA0)* 31(SDIO_DATA3)* 32(SDIO_CLK)* 34(GPIO6)* 35(HSIC_STROBE)* 36(HSIC_DATA)* 42(NC)* 44(VDD_AUX)* 45(ISINK)* 46(ADC2)* 47(ADC1)* 48(SD_DET)* 50(GPIO43*)* 52(GPIO41)* 53(USIM_DET)* 54(FLIGHTMODE)* 55(SCL)* 56(SDA)* 59(AUX_ANT)* 66(RTS)* 67(CTS)* 68(RXD)* 70(DCD)* 71(TXD)* 72(DTR)* 73(PCM_OUT)* 74(PCM_IN)* 75(PCM_SYNC)* 76(PCM_CLK)* 83(COEX1*)* 84(COEX2)* 85(BOOT_CFG0*)* 86(COEX3*)* 87(GPIO77)*; U7 14(HEC)*; USB1 A2(SSTXp1)* A3(SSTXn1)* A8(SBU1)* A10(SSRXn2)* A11(SSRXp2)* B2(SSTXp2)* B3(SSTXn2)* B8(SBU2)* B10(SSRXn1)* B11(SSRXp1)*

## Notes on the sheets
sheet 1
- OPI CM4 CONNECTORS
sheet 2
- SPEAKER CIRCUIT
- HEAD PHONE CIRCUIT
- MICRO PHONE CIRCUIT
- USB2_CAMERA_CONNECTOR
sheet 3
- SIM MODULE
- SIM CARD HOLDER
- STATUS LEDS
sheet 4
- Type C Charging Port
- Recommended circuit for SIM Module
- VOLTAGE COMING FROM
- VOLTAGE GOING TO
- CHARGING CIRCUIT
- SIM MODULE
- VOLTAGE COMING FROM
- IP3506 CHARGING CIRCUIT
- CHARGING PORT
- OUT GOING 5 VOLTS
sheet 5
- HDMI PORT
- PUSH BUTTONS
